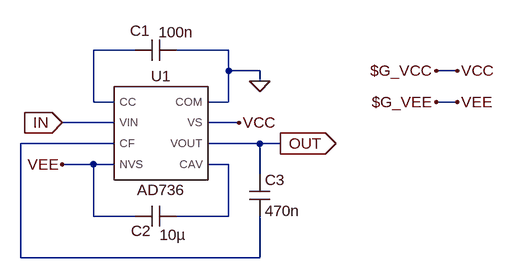
[diagram p0: schematic Boltz-4-rms.asc]
Boltz-4-rms.asc, the LTspice schematic file:
Version 4
SHEET 1 892 680
WIRE 336 176 272 176
WIRE 480 176 400 176
WIRE 480 208 480 176
WIRE 528 208 480 208
WIRE 832 208 800 208
WIRE 528 224 528 208
WIRE 272 256 272 176
WIRE 304 256 272 256
WIRE 480 256 480 208
WIRE 480 256 448 256
WIRE 832 256 800 256
WIRE 304 288 224 288
WIRE 496 288 448 288
WIRE 304 320 160 320
WIRE 528 320 448 320
WIRE 560 320 528 320
WIRE 272 352 224 352
WIRE 304 352 272 352
WIRE 480 352 448 352
WIRE 528 368 528 320
WIRE 272 432 272 352
WIRE 336 432 272 432
WIRE 480 432 480 352
WIRE 480 432 400 432
WIRE 160 496 160 320
WIRE 528 496 528 432
WIRE 528 496 160 496
FLAG 528 224 0
FLAG 224 352 VEE
FLAG 496 288 VCC
FLAG 224 288 IN
IOPIN 224 288 In
FLAG 560 320 OUT
IOPIN 560 320 Out
FLAG 800 208 $G_VCC
FLAG 832 208 VCC
FLAG 800 256 $G_VEE
FLAG 832 256 VEE
SYMBOL AD736 368 304 R0
SYMATTR InstName U1
SYMBOL cap 336 192 R270
WINDOW 0 30 8 VTop 2
WINDOW 3 59 63 VBottom 2
SYMATTR InstName C1
SYMATTR Value 100n
SYMBOL cap 336 448 R270
WINDOW 0 -22 9 VTop 2
WINDOW 3 3 58 VBottom 2
SYMATTR InstName C2
SYMATTR Value 10µ
SYMBOL cap 512 368 R0
SYMATTR InstName C3
SYMATTR Value 470n

The netlist it stands for:
* Boltz-4-rms.asc
XU1 N001 IN N002 $G_VEE 0 $G_VCC OUT N003 AD736  ; pins CC VIN CF NVS COM VS VOUT CAV
C1 N001 0 100n
C2 $G_VEE N003 10µ
C3 OUT N002 470n
.lib /Users/forti/Google Drive/Laboratorio 3/2015-16/Esercitazioni/Es15.Boltzman/Boltzman schematics/ad736.cir
.backanno
.end